# EAGLE design 2mos6 (EAGLE 5.10)
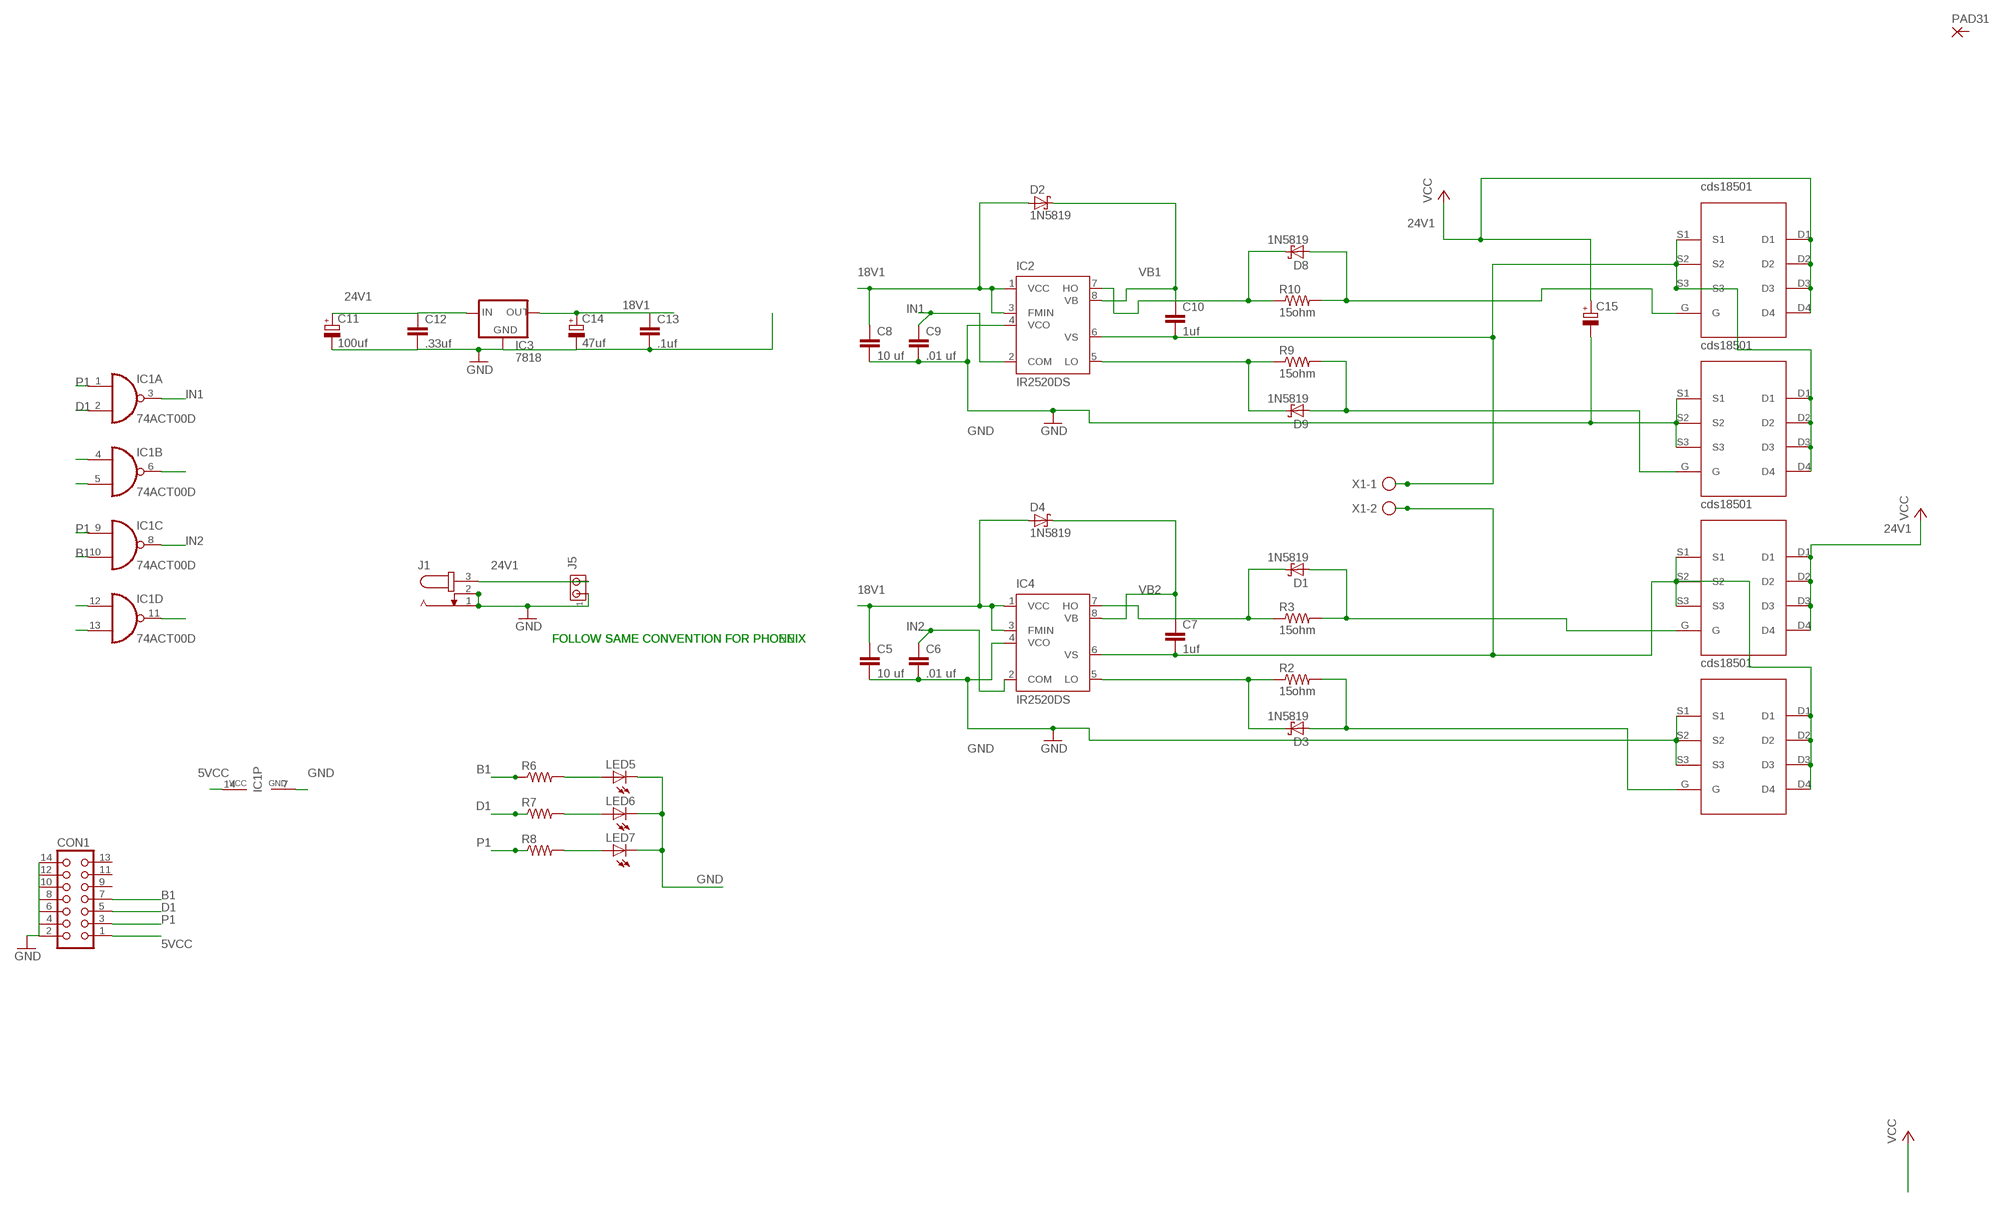
[diagram p0: schematic, sheet 1]

## Parts
C5  10 uf  C-EUC0603  [C0603]
C6  .01 uf  C-EUC0603  [C0603]
C7  1uf  C-EUC0603  [C0603]
C8  10 uf  C-EUC0603  [C0603]
C9  .01 uf  C-EUC0603  [C0603]
C10  1uf  C-EUC0603  [C0603]
C11  100uf  CPOL-EUE2.5-7  [E2,5-7]
C12  .33uf  C-EUC0603  [C0603]
C13  .1uf  C-EUC0603  [C0603]
C14  47uf  CPOL-EUE2.5-7  [E2,5-7]
C15  CPOL-EUE3.5-10  [E3,5-10]
CON1  CON14L  [CON14L]
D1  1N5819  SCHOTTKY-DIODESMD  [SMB]
D2  1N5819  SCHOTTKY-DIODESMD  [SMB]
D3  1N5819  SCHOTTKY-DIODESMD  [SMB]
D4  1N5819  SCHOTTKY-DIODESMD  [SMB]
D8  1N5819  SCHOTTKY-DIODESMD  [SMB]
D9  1N5819  SCHOTTKY-DIODESMD  [SMB]
IC1  74ACT00D  [SO14]
IC2  IR2520DS  [SO08]
IC3  7818  78XXS  [78XXS]
IC4  IR2520DS  [SO08]
J1  JACK-PLUG1  [SPC4078]
J5  MTA02-100  [10X02MTA]
LED5  LEDCHIPLED_0603  [CHIPLED_0603]
LED6  LEDCHIPLED_0603  [CHIPLED_0603]
LED7  LEDCHIPLED_0603  [CHIPLED_0603]
PAD31  1,6/0,8HOLE00  [1,6/0,8]
R2  15ohm  R-US_R0603  [R0603]
R3  15ohm  R-US_R0603  [R0603]
R6  R-US_R0603  [R0603]
R7  R-US_R0603  [R0603]
R8  R-US_R0603  [R0603]
R9  15ohm  R-US_R0603  [R0603]
R10  15ohm  R-US_R0603  [R0603]
U$1  CSD18503GDS-NEW  [CDS]
U$2  CSD18503GDS-NEW  [CDS]
U$3  CSD18503GDS-NEW  [CDS]
U$4  CSD18503GDS-NEW  [CDS]
X1  AK300/2  [AK300/2]

## Nets
5VCC: CON1.1 IC1.14(P:VCC)
18V1: C5.1 C8.1 C13.1 C14.+ D2.A D4.A IC2.1(VCC) IC2.3(FMIN) IC3.OUT IC4.1(VCC) IC4.3(FMIN)
24V1: C11.+ C12.1 C15.+ IC3.IN J1.3 J5.2 U$1.D1 U$1.D2 U$1.D3 U$1.D4 U$3.D1 U$3.D2 U$3.D3 U$3.D4 ; supply symbol labelled VCC
B1: CON1.7 IC1.10(C:I1) R6.1
D1: CON1.5 IC1.2(A:I1) R7.1
GND: C5.2 C6.2 C8.2 C9.2 C11.- C12.2 C13.2 C14.- C15.- CON1.2 CON1.4 CON1.6 CON1.8 CON1.10 CON1.12 CON1.14 IC1.7(P:GND) IC2.4(VCO) IC3.GND IC4.4(VCO) J1.1 J1.2 J5.1 LED5.C LED6.C LED7.C U$2.S1 U$2.S2 U$2.S3 U$4.S1 U$4.S2 U$4.S3
IN1: C9.1 IC1.3(A:O) IC2.2(COM)
IN2: C6.1 IC1.8(C:O) IC4.2(COM)
N$2: D3.C IC4.5(LO) R2.1
N$4: C7.2 IC4.6(VS) U$3.S1 U$3.S2 U$3.S3 U$4.D1 U$4.D2 U$4.D3 U$4.D4 X1.2
N$6: IC1.4(B:I0)
N$7: IC1.5(B:I1)
N$8: IC1.6(B:O)
N$12: D8.A R10.2 U$1.G
N$13: D1.C IC4.7(HO) R3.1
N$14: D1.A R3.2 U$3.G
N$15: D3.A R2.2 U$4.G
N$16: IC1.12(D:I0)
N$17: C10.2 IC2.6(VS) U$1.S1 U$1.S2 U$1.S3 U$2.D1 U$2.D2 U$2.D3 U$2.D4 X1.1
N$18: IC1.13(D:I1)
N$19: IC1.11(D:O)
N$23: D9.C IC2.5(LO) R9.1
N$24: D9.A R9.2 U$2.G
N$25: D8.C IC2.7(HO) R10.1
N$33: LED5.A R6.2
N$34: LED6.A R7.2
N$35: LED7.A R8.2
P1: CON1.3 IC1.1(A:I0) IC1.9(C:I0) R8.1
VB1: C10.1 D2.C IC2.8(VB)
VB2: C7.1 D4.C IC4.8(VB)
Unconnected: CON1.9 CON1.11 CON1.13 PAD31.1(P)

## Notes on the sheet
- FOLLOW SAME CONVENTION FOR PHOENIX | FOLLOW SAME CONVENTION FOR PHONEIX

## Library data of the parts
C5-C10 C12 C13 = rcl:C-EU: CAPACITOR, European symbol
C11 C14 = resistor:CPOL-EU: POLARIZED CAPACITOR, European symbol
C15 = rcl:CPOL-EU: POLARIZED CAPACITOR, European symbol
CON1 = con-harting:CON14L: CONNECTOR
D1-D4 D8 D9 = diode:SCHOTTKY-DIODE: Schottky Diode
IC1 = 74xx-eu:74*00: Quad 2-input NAND gate
IC2 IC4 = ir:IR2520D: ADAPTIVE BALLAST CONTROL IC The IR2520D(S) is a complete adaptive ballast controller and 600V half-bridge driver integrated into a single IC for fluorescent lighting applications. Data Sheet No. PD60212 Rev A Source: www.irf.com .. ir2520.pdf
IC3 = v-reg:78XXS: VOLTAGE REGULATOR
J1 = con-jack:JACK-PLUG: DC POWER JACK Power Jack, DC, Right Angle, Through Hole, Rated 5A at 16VDC, PC Terminals Distributor: Farnell (www.Farnell.de) Drawing: 84N1161.pdf / 84N1162.pdf Manufacturer: SPC Technology (www.spctechnology.com) Type: SPC4077 / SPC 4078
J5 = con-amp:MTA02-100: AMP connector
LED5-LED7 = led:LED: LED OSRAM: - CHIPLED LG R971, LG N971, LY N971, LG Q971, LY Q971, LO R971, LY R971 LH N974, LH R974 LS Q976, LO Q976, LY Q976 LO Q996 - Hyper CHIPLED LW Q18S LB Q993, LB Q99A, LB R99A - SideLED LS A670, LO A670, LY A670, LG A670, LP A670 LB A673, LV A673, LT A673, LW A673 LH A674 LY A675 LS A676, LA A676, LO A676, LY A676, LW A676 LS A679, LY A679, LG A679 - Hyper Micro SIDELED® LS Y876, LA Y876, LO Y876, LY Y876 LT Y87S - SmartLED LW L88C, LW L88S LB L89C, LB L89S, LG L890 LS L89K, LO L89K, LY L89K LS L896, LA L896, LO L896, LY L896 - TOPLED LS T670, LO T670, LY T670, LG T670, LP T670 LSG T670, LSP T670, LSY T670, LOP T670, LYG T670 LG T671, LOG T671, LSG T671 LB T673, LV T673, LT T673, LW T673 LH T674 LS T676, LA T676, LO T676, LY T676, LB T676, LH T676, LSB T676, LW T676 LB T67C, LV T67C, LT T67C, LS T67K, LO T67K, LY T67K, LW E67C LS E67B, LA E67B, LO E67B, LY E67B, LB E67C, LV E67C, LT E67C LW T67C LS T679, LY T679, LG T679 LS T770, LO T770, LY T770, LG T770, LP T770 LB T773, LV T773, LT T773, LW T773 LH T774 LS E675, LA E675, LY E675, LS T675 LS T776, LA T776, LO T776, LY T776, LB T776 LHGB T686 LT T68C, LB T68C - Hyper Mini TOPLED® LB M676 - Mini TOPLED Santana® LG M470 LS M47K, LO M47K, LY M47K Source: http://www.osram.convergy.de LUXEON: - LUMILED® LXK2-PW12-R00, LXK2-PW12-S00, LXK2-PW14-U00, LXK2-PW14-V00 LXK2-PM12-R00, LXK2-PM12-S00, LXK2-PM14-U00 LXK2-PE12-Q00, LXK2-PE12-R00, LXK2-PE12-S00, LXK2-PE14-T00, LXK2-PE14-U00 LXK2-PB12-K00, LXK2-PB12-L00, LXK2-PB12-M00, LXK2-PB14-N00, LXK2-PB14-P00, LXK2-PB14-Q00 LXK2-PR12-L00, LXK2-PR12-M00, LXK2-PR14-Q00, LXK2-PR14-R00 LXK2-PD12-Q00, LXK2-PD12-R00, LXK2-PD12-S00 LXK2-PH12-R00, LXK2-PH12-S00 LXK2-PL12-P00, LXK2-PL12-Q00, LXK2-PL12-R00 Source: www.luxeon.com KINGBRIGHT: KA-3528ASYC Source: www.kingbright.com
PAD31 = hole00:1,6/0,8: THROUGH-HOLE PAD
R2 R3 R6-R10 = rcl:R-US_: RESISTOR, American symbol
U$1-U$4 = cds_new:CSD18503GDS-NEW
X1 = con-ptr500:AK300/2: CONNECTOR

## Board
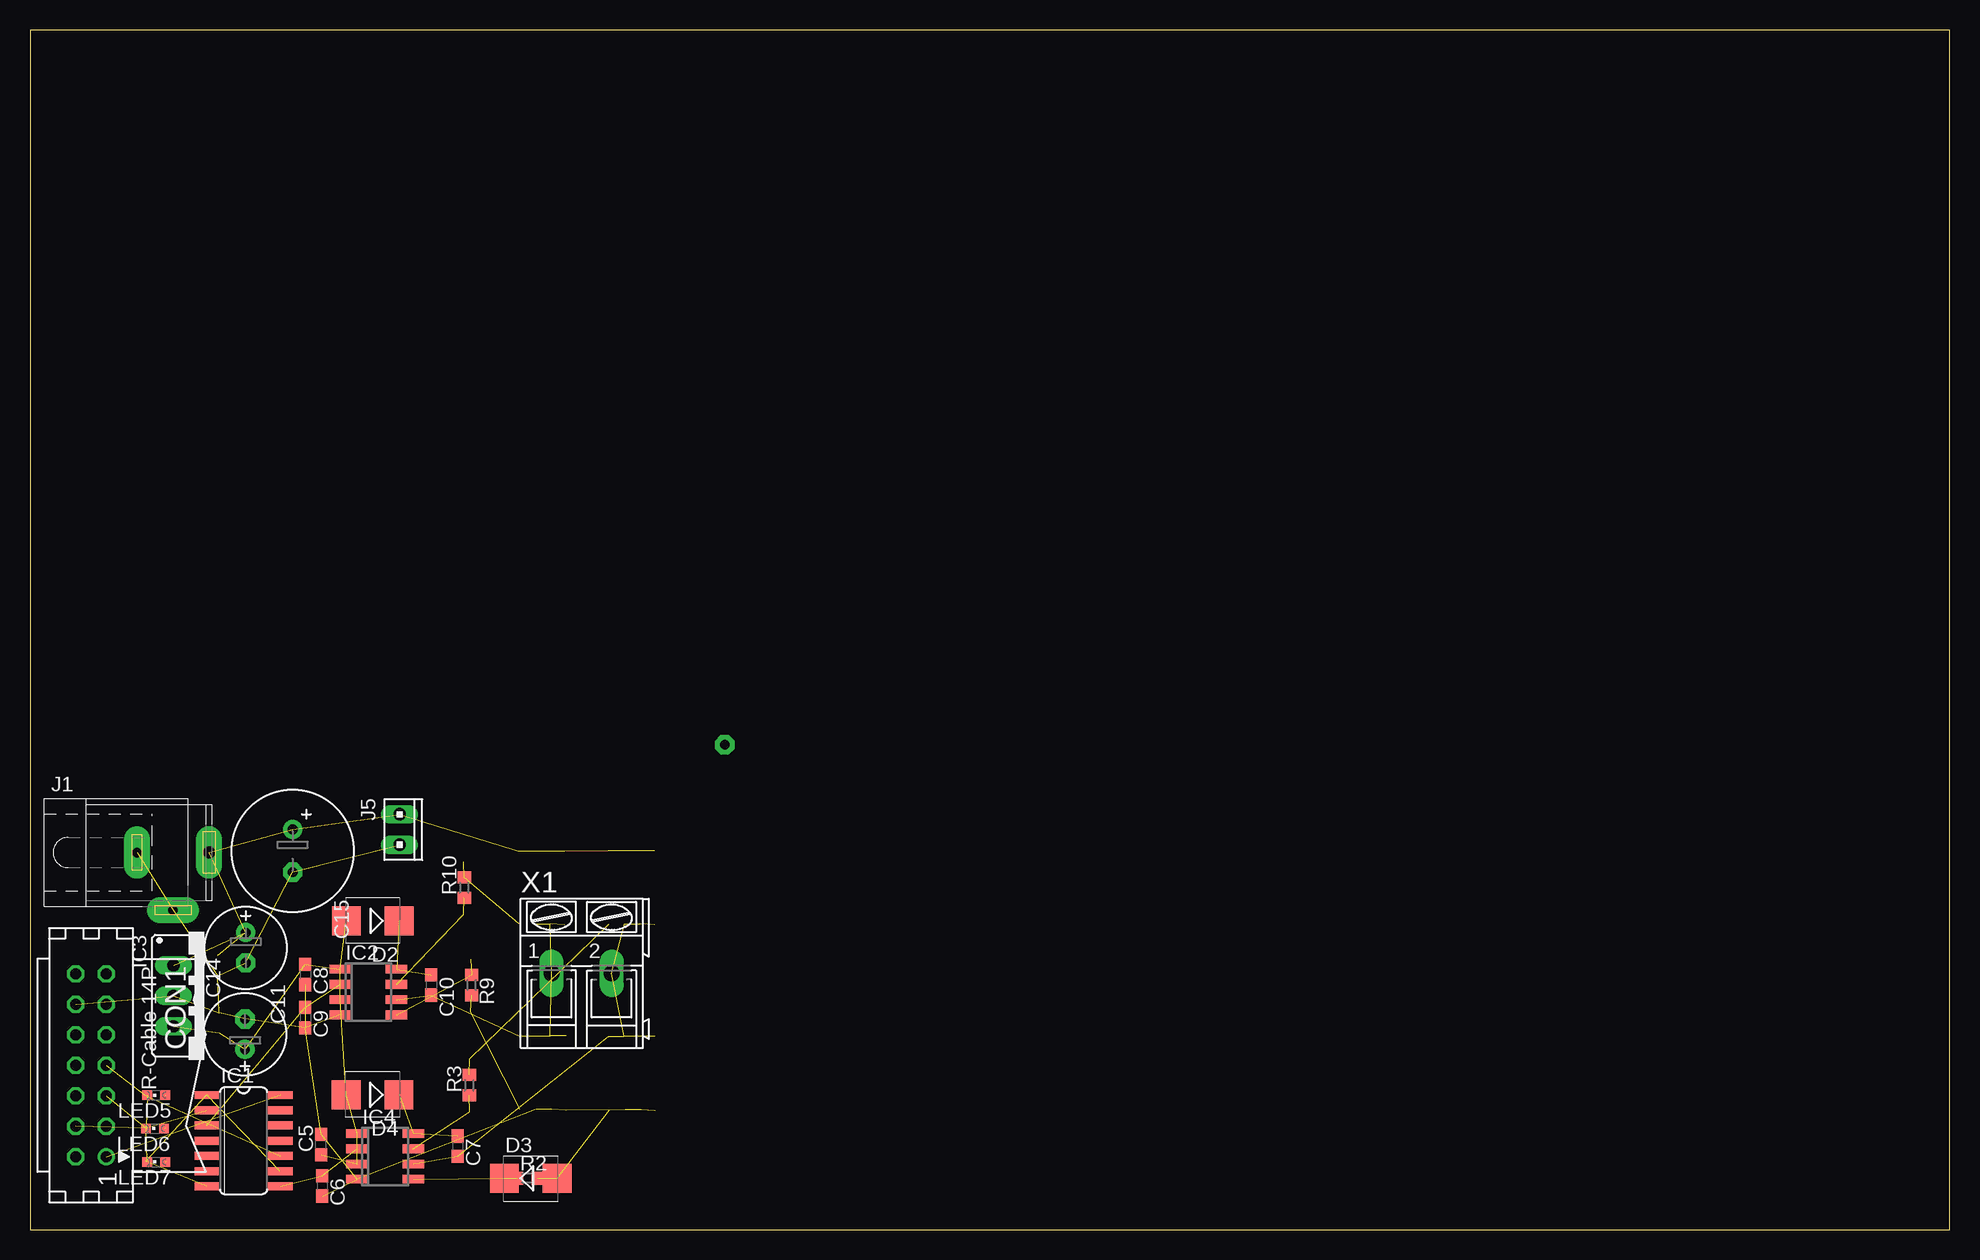
[diagram p1: board, top side]
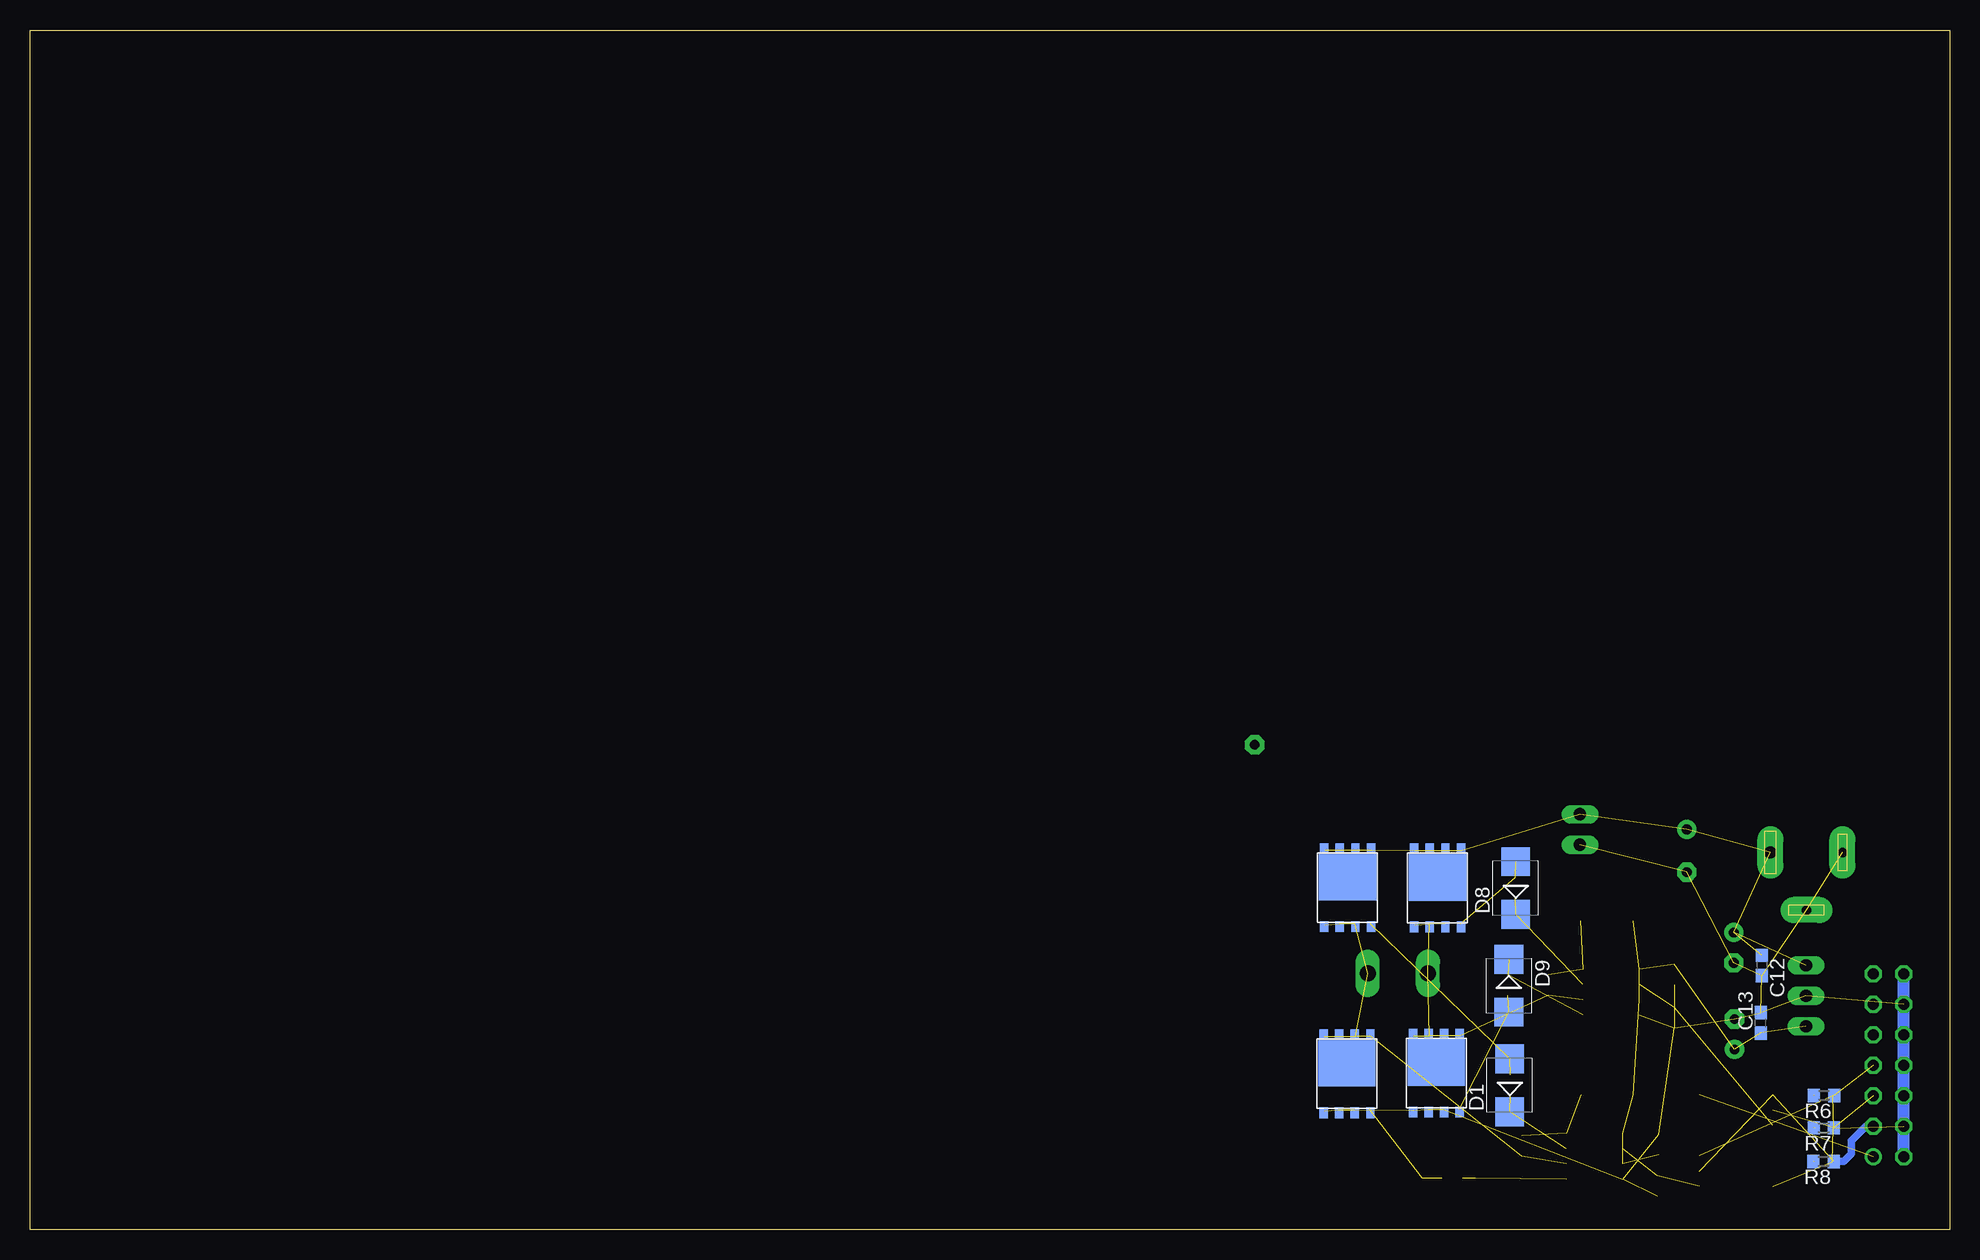
[diagram p2: board, bottom side, seen from below]

Size 160 x 100 mm. Coordinates in mm from the lower left corner, seen from the top.
Outline: 0,0 160,0 160,100 0,100 0,0
Copper layers (1*16): Top 0.035mm / dielectric 1.5mm / Bottom 0.035mm
Design rules "default": minimum track width 10mil, minimum drill 24mil, track to track 8mil, track to pad 8mil, pad to pad 8mil, via to via 8mil, smd to smd 8mil, copper to edge 40mil, drill to drill 8mil, minimum pad ring 10mil, minimum via ring 8mil, stop-mask expansion 4mil, vias tented up to drill 0mil, thermal gap 10mil

### Footprints (pad centres in the part's own frame; a part is rotated, then mirrored left to right if it is on the bottom)
C0603 = smd 1.1 x 1: 1 -0.85,0; 2 0.85,0
E2,5-7 = drill 0.813 pad 1.6 round: + -1.27,0 | drill 0.813 pad 1.6 octagon: - 1.27,0
E3,5-10 = drill 0.813 pad 1.6 round: + -1.778,0 | drill 0.813 pad 1.6 octagon: - 1.778,0
CON14L = drill 0.914 round: 1 7.62,1.27 | drill 0.914 octagon: 2 7.62,-1.27; 3 5.08,1.27; 4 5.08,-1.27; 5 2.54,1.27; 6 2.54,-1.27; 7 0,1.27; 8 0,-1.27; 9 -2.54,1.27; 10 -2.54,-1.27; 11 -5.08,1.27; 12 -5.08,-1.27; 13 -7.62,1.27; 14 -7.62,-1.27
SMB = smd 2.4 x 2.4: A 2.2,0; C -2.2,0
SO14 = smd 0.66 x 2.032: 1 -3.81,-3.073; 2 -2.54,-3.073; 3 -1.27,-3.073; 4 0,-3.073; 5 1.27,-3.073; 6 2.54,-3.073; 7 3.81,-3.073; 8 3.81,3.073; 9 2.54,3.073; 10 1.27,3.073; 11 0,3.073; 12 -1.27,3.073; 13 -2.54,3.073; 14 -3.81,3.073
SO08 = smd 0.72 x 1.78: 1 -1.905,-2.35; 2 -0.635,-2.35; 3 0.635,-2.35; 4 1.905,-2.35; 5 1.905,2.35; 6 0.635,2.35; 7 -0.635,2.35; 8 -1.905,2.35
78XXS = drill 1.016 long: GND 0,-2.54; IN -2.54,-2.54; OUT 2.54,-2.54
SPC4078 = drill 0.8 pad 2.184 long: 1 -3,0; 2 0,-4.8 | drill 1 pad 2.184 long: 3 3,0
10X02MTA = drill 1.016 long: 1 1.27,0; 2 -1.27,0
CHIPLED_0603 = smd 0.8 x 0.8: A 0,-0.75; C 0,0.75
1,6/0,8 = drill 0.813 pad 1.6 octagon: 1 0,0
R0603 = smd 1 x 1.1: 1 -0.85,0; 2 0.85,0
CDS = smd 0.406 x 0.203: D1 1,-0.9; D2 1,0.4; D3 1,1.7; D4 1,3; G 7.1,2.9; P$1 7.2,3.1; P$2 7.2,2.9; P$3 7.2,2.7; P$4 7.5,1.9; P$5 7.6,3.1; P$6 7.6,2.9; P$7 7.6,2.7; P$8 7.6,1.9; P$9 7.1,3.1; P$11 7.1,2.7; P$12 7.5,1.7; P$13 7.2,-1.1; P$14 7.6,-1.1; P$16 7.6,-0.9; P$17 7.1,-0.9; P$18 7.1,-1.1; P$19 7.1,-0.7; P$20 7.5,-0.7; P$21 7.6,-0.7; P$22 7.1,-1.2; P$23 7.5,-1.2; P$24 7.6,-1.2; P$25 7.1,3.2; P$26 7.5,3.2; P$27 7.6,3.2; P$28 7.1,0.1; P$30 7.1,0.5; P$31 7.1,0.6; P$32 7.1,1.4; P$34 7.1,1.8; P$35 7.1,1.9; P$36 7.6,1.7; P$37 7.5,1.5; P$38 7.6,1.5; P$39 7.5,1.4; P$40 7.6,1.4; P$41 7.5,0.6; P$42 7.6,0.6; P$43 7.5,0.4; P$44 7.6,0.4; P$45 7.5,0.2; P$46 7.6,0.2; P$47 7.5,0.1; P$48 7.6,0.1; P$68 1,3.2; P$69 0.6,3.2; P$70 0.6,3; P$72 1.1,3.2; P$73 1.2,3; P$74 0.6,2.8; P$75 1,2.8; P$76 1.1,2.8; P$77 0.6,2.7; P$78 1,2.7; P$79 1.1,2.7; P$80 1.1,1.9; P$81 0.7,1.9; P$82 0.6,1.9; P$83 0.6,1.7; P$85 1.1,1.7; P$86 0.6,1.5; P$87 1,1.5; P$88 1.2,1.5; P$89 0.6,1.4; P$90 1,1.4; P$91 1.2,1.4; P$92 0.6,0.6; P$93 1,0.6; P$94 1.1,0.6; P$95 0.6,0.4; P$97 1.2,0.4; P$98 0.6,0.2; P$99 1,0.2; P$100 1.2,0.2; P$101 0.6,0.1; P$102 1,0.1; P$103 1.1,0.1; P$104 0.6,-0.7; P$105 0.9,-0.7; P$106 1.1,-0.7; P$107 0.6,-0.9; P$109 1.1,-0.9; P$110 0.6,-1.1; P$111 1.1,-1.1; P$112 1,-1.1; P$113 0.6,-1.2; P$114 1,-1.2; P$115 1.1,-1.2; S1 7.2,-0.9; S2 7.1,0.3; S3 7.1,1.6 | smd 1.93 x 0.965: P$49 4.2,-0.9; P$50 2.3,-0.9; P$51 2.3,0; P$52 4.2,0; P$53 4.2,0.9; P$54 2.3,0.9; P$55 4.2,1.8; P$56 2.3,1.8; P$57 2.3,2.7; P$58 4.2,2.7; P$59 4.2,2.9; P$60 2.3,2.9; P$61 2.2,2.9; P$62 2.2,1.9; P$63 2.2,2; P$64 2.2,1; P$65 2.2,0; P$66 2.2,0.1; P$67 2.2,-0.9
AK300/2 = drill 1.321 long: 1 -2.515,0; 2 2.489,0

### Placement (x,y rotation side)
C5  24.25,7.09 90 top
C6  24.35,3.64 270 top
C7  35.65,6.95 270 top
C8  22.95,21.26 270 top
C9  22.95,17.66 270 top
C10  33.45,20.39 270 top
C11  17.98,23.49 270 top
C12  15.65,22.01 270 bottom
C13  15.75,17.23 90 bottom
C14  17.92,16.28 90 top
C15  21.89,31.57 270 top
CON1  5.08,13.69 270 top
D1  36.66,12.02 90 bottom
D2  28.57,25.74 180 top
D3  41.74,4.26 0 top
D4  28.55,11.24 180 top
D8  36.16,28.46 90 bottom
D9  36.74,20.33 270 bottom
IC1  17.8,7.4 270 top
IC2  28.2,19.8 270 top
IC3  14.5,19.49 270 top
IC4  29.6,6.1 270 top
J1  11.92,31.43 0 top
J5  30.8,33.35 270 top
LED5  10.52,11.2 90 top
LED6  10.42,8.42 90 top
LED7  10.52,5.64 90 top
PAD31  57.91,40.41 0 top
R2  41.45,4.28 0 top
R3  36.62,12.03 90 top
R6  10.46,11.17 180 bottom
R7  10.48,8.47 180 bottom
R8  10.5,5.67 180 bottom
R9  36.8,20.38 270 top
R10  36.2,28.5 90 top
U$1  43.67,32.58 270 bottom
U$2  43.77,17.14 270 bottom
U$3  51.17,32.6 270 bottom
U$4  51.22,17.09 270 bottom
X1  45.99,21.35 0 top

### Tracks (layer width: path | path; a pad name or v marks a point on that pad's centre or on a via)
5VCC  (1 unrouted)
18V1  (10 unrouted)
24V1  (13 unrouted)
B1  (2 unrouted)
D1  (2 unrouted)
GND  (25 unrouted)
  Bottom 1.016: CON1.2 CON1.4 CON1.6 CON1.8 CON1.10 CON1.12 CON1.14
IN1  (2 unrouted)
IN2  (2 unrouted)
N$2  (2 unrouted)
N$4  (9 unrouted)
N$12  (2 unrouted)
N$13  (2 unrouted)
N$14  (2 unrouted)
N$15  (2 unrouted)
N$17  (9 unrouted)
N$23  (2 unrouted)
N$24  (2 unrouted)
N$25  (2 unrouted)
N$33  (1 unrouted)
N$34  (1 unrouted)
N$35  (1 unrouted)
P1  (2 unrouted)
  Bottom 0.61: CON1.3 6.99,8.61 8.2,7.4 8.2,6.3 8.8,5.7 9.62,5.7 R8.1
VB1  (2 unrouted)
VB2  (2 unrouted)